# Altium schematic sheet Control.SchDoc
size A; DocumentNumber: 4; SheetNumber: 4; SheetTotal: 4
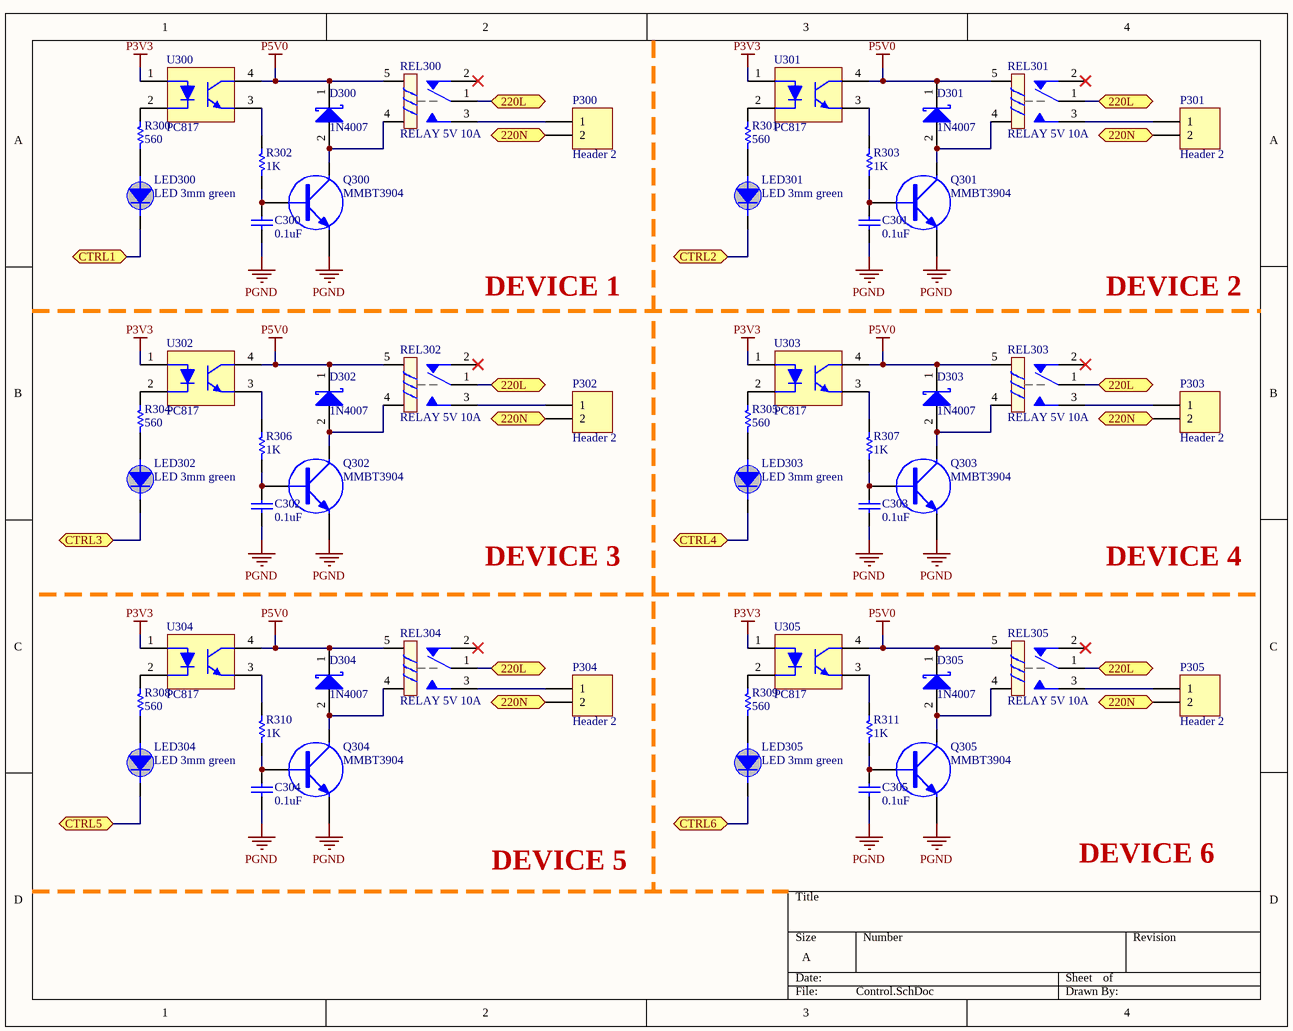
[diagram p0: Control.SchDoc]

## Parts
C300  0.1uF  [0805 cap]
C301  0.1uF  [0805 cap]
C302  0.1uF  [0805 cap]
C303  0.1uF  [0805 cap]
C304  0.1uF  [0805 cap]
C305  0.1uF  [0805 cap]
D300  1N4007  [SMA-diode]
D301  1N4007  [SMA-diode]
D302  1N4007  [SMA-diode]
D303  1N4007  [SMA-diode]
D304  1N4007  [SMA-diode]
D305  1N4007  [SMA-diode]
LED300  LED 3mm green  [LED 3mm green]
LED301  LED 3mm green  [LED 3mm green]
LED302  LED 3mm green  [LED 3mm green]
LED303  LED 3mm green  [LED 3mm green]
LED304  LED 3mm green  [LED 3mm green]
LED305  LED 3mm green  [LED 3mm green]
P300  Header 2  [HED2T]
P301  Header 2  [HED2T]
P302  Header 2  [HED2T]
P303  Header 2  [HED2T]
P304  Header 2  [HED2T]
P305  Header 2  [HED2T]
Q300  MMBT3904  [SOT23-3LN]
Q301  MMBT3904  [SOT23-3LN]
Q302  MMBT3904  [SOT23-3LN]
Q303  MMBT3904  [SOT23-3LN]
Q304  MMBT3904  [SOT23-3LN]
Q305  MMBT3904  [SOT23-3LN]
R300  560  [0805 Resistor]
R301  560  [0805 Resistor]
R302  1K  [0805 Resistor]
R303  1K  [0805 Resistor]
R304  560  [0805 Resistor]
R305  560  [0805 Resistor]
R306  1K  [0805 Resistor]
R307  1K  [0805 Resistor]
R308  560  [0805 Resistor]
R309  560  [0805 Resistor]
R310  1K  [0805 Resistor]
R311  1K  [0805 Resistor]
REL300  RELAY 5V 10A  [RELAY 5V-10A]
REL301  RELAY 5V 10A  [RELAY 5V-10A]
REL302  RELAY 5V 10A  [RELAY 5V-10A]
REL303  RELAY 5V 10A  [RELAY 5V-10A]
REL304  RELAY 5V 10A  [RELAY 5V-10A]
REL305  RELAY 5V 10A  [RELAY 5V-10A]
U300  PC817  [PC817 SMD]
U301  PC817  [PC817 SMD]
U302  PC817  [PC817 SMD]
U303  PC817  [PC817 SMD]
U304  PC817  [PC817 SMD]
U305  PC817  [PC817 SMD]

## Ports
220L, 220N, CTRL1, CTRL2, CTRL3, CTRL4, CTRL5, CTRL6

## Nets
P3V3: U300.1 U301.1 U302.1 U303.1 U304.1 U305.1
P5V0: D300.1(K) D301.1(K) D302.1(K) D303.1(K) D304.1(K) D305.1(K) REL300.5 REL301.5 REL302.5 REL303.5 REL304.5 REL305.5 U300.4 U301.4 U302.4 U303.4 U304.4 U305.4
PGND: C300.1 C301.1 C302.1 C303.1 C304.1 C305.1 Q300.3(E) Q301.3(E) Q302.3(E) Q303.3(E) Q304.3(E) Q305.3(E)
220L: REL300.1 REL301.1 REL302.1 REL303.1 REL304.1 REL305.1 ; port 220L
220N: P300.2 P301.2 P302.2 P303.2 P304.2 P305.2 ; port 220N
CTRL1: LED300.2(Katot) ; port CTRL1
CTRL2: LED301.2(Katot) ; port CTRL2
CTRL3: LED302.2(Katot) ; port CTRL3
CTRL4: LED303.2(Katot) ; port CTRL4
CTRL5: LED304.2(Katot) ; port CTRL5
CTRL6: LED305.2(Katot) ; port CTRL6
NetC300_2: C300.2 Q300.1(B) R302.2
NetC301_2: C301.2 Q301.1(B) R303.2
NetC302_2: C302.2 Q302.1(B) R306.2
NetC303_2: C303.2 Q303.1(B) R307.2
NetC304_2: C304.2 Q304.1(B) R310.2
NetC305_2: C305.2 Q305.1(B) R311.2
NetD300_2: D300.2(A) Q300.2(C) REL300.4
NetD301_2: D301.2(A) Q301.2(C) REL301.4
NetD302_2: D302.2(A) Q302.2(C) REL302.4
NetD303_2: D303.2(A) Q303.2(C) REL303.4
NetD304_2: D304.2(A) Q304.2(C) REL304.4
NetD305_2: D305.2(A) Q305.2(C) REL305.4
NetLED300_1: LED300.1(anot) R300.2
NetLED301_1: LED301.1(anot) R301.2
NetLED302_1: LED302.1(anot) R304.2
NetLED303_1: LED303.1(anot) R305.2
NetLED304_1: LED304.1(anot) R308.2
NetLED305_1: LED305.1(anot) R309.2
NetP300_1: P300.1 REL300.3
NetP301_1: P301.1 REL301.3
NetP302_1: P302.1 REL302.3
NetP303_1: P303.1 REL303.3
NetP304_1: P304.1 REL304.3
NetP305_1: P305.1 REL305.3
NetR300_1: R300.1 U300.2
NetR301_1: R301.1 U301.2
NetR302_1: R302.1 U300.3
NetR303_1: R303.1 U301.3
NetR304_1: R304.1 U302.2
NetR305_1: R305.1 U303.2
NetR306_1: R306.1 U302.3
NetR307_1: R307.1 U303.3
NetR308_1: R308.1 U304.2
NetR309_1: R309.1 U305.2
NetR310_1: R310.1 U304.3
NetR311_1: R311.1 U305.3

Not connected (* = marked no-connect by the designer): REL300 2*; REL301 2*; REL302 2*; REL303 2*; REL304 2*; REL305 2*

## Notes on the sheet
- DEVICE 1
- DEVICE 2
- DEVICE 3
- DEVICE 4
- DEVICE 5
- DEVICE 6

## Library data of the parts
C300-C305 = cap SMD
D300-D305 = Diode Schottky
P300-P305 = Header 2: Header, 2-Pin; LatestRevisionDate: 17-Jul-2002; LatestRevisionNote: Re-released for DXP Platform.; Publisher: Altium Limited
Q300-Q305 = MMBT3904: TRANS NPN 40V 0.2A SOT-23; Manufacturer: Fairchild/ON Semiconductor; Current - Collector (Ic) (Max): 200mA; Vce Saturation (Max) @ Ib, Ic: 300mV @ 5mA, 50mA; DC Current Gain (hFE) (Min) @ Ic, Vce: 100 @ 10mA, 1V; Power - Max: 350mW; Frequency - Transition: 300MHz; Supplier 1: Digi-Key; Manufacturer Part Number: MMBT3904; RoHS: RoHS Compliant; Category: Discrete Semiconductor Products; Stock 1: 366264; Pricing 1: 1=0.16, 10=0.149, 100=0.0812, 500=0.04998, 1000=0.03408 (USD); Packaging: Cut Tape (CT); Part Status: Active; Transistor Type: NPN; Voltage - Collector Emitter Breakdown (Max): 40V; Current - Collector Cutoff (Max): -; Operating Temperature: -55°C ~ 150°C (TJ); Mounting Type: Surface Mount; Package / Case: TO-236-3, SC-59, SOT-23-3; Supplier Device Package: SOT-23-3; ComponentLink1URL: https://www.fairchildsemi.com/datasheets/MM/MMBT3904.pdf; ComponentLink1Description: https://www.fairchildsemi.com/datasheets/MM/MMBT3904.pdf; Supplier Part Number 1: MMBT3904FSCT-ND
R300-R311 = Resistor